# EAGLE design medal (EAGLE 6.5.0)

## Sheet 1 of 5
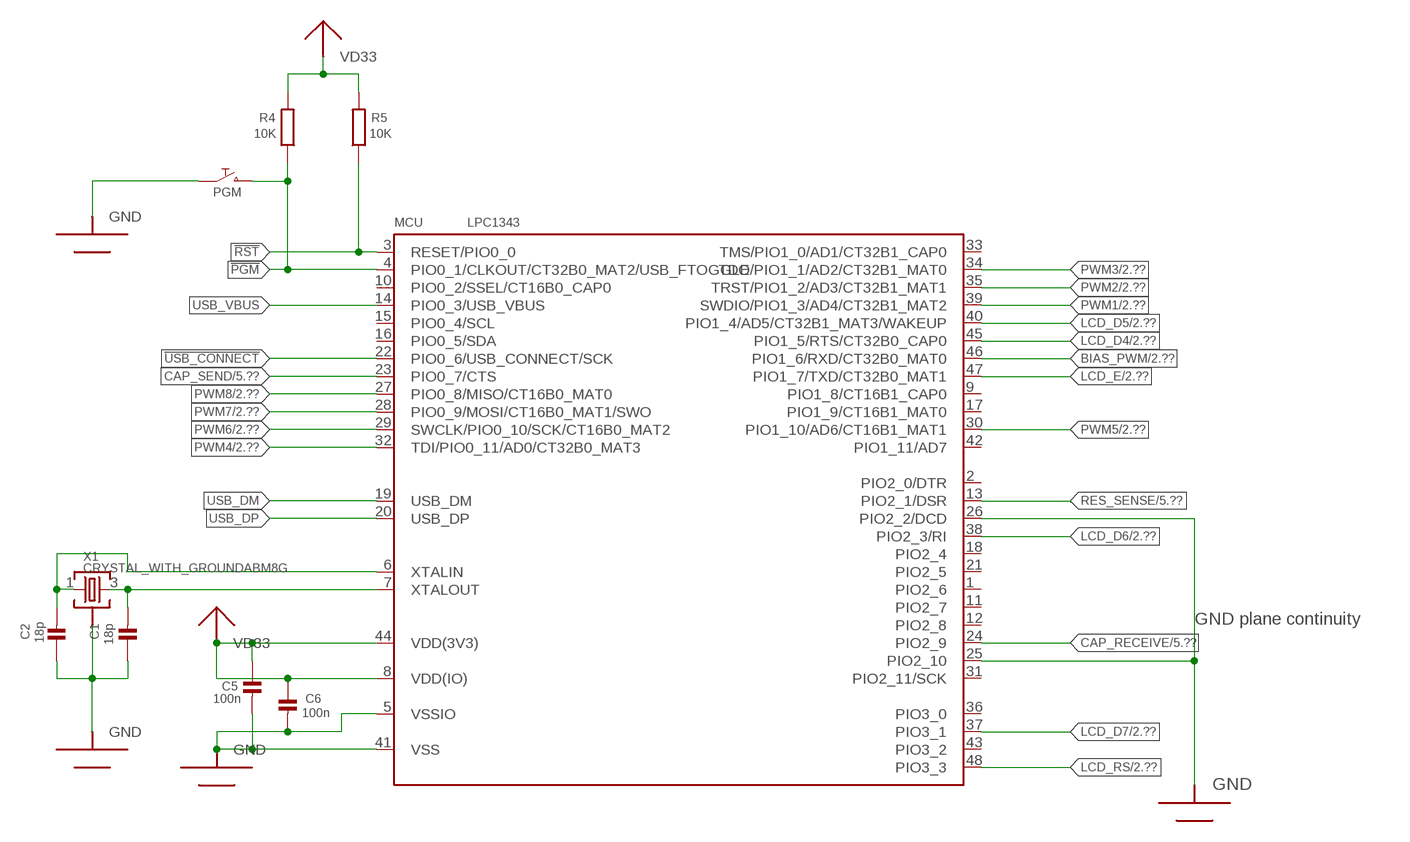
[diagram p0: schematic, sheet 1]

### Parts
C1  18p  CAP_CERAMIC0603-NOSILK  [0603-NOSILK]
C2  18p  CAP_CERAMIC0603-NOSILK  [0603-NOSILK]
C5  100n  CAP_CERAMIC0603-NOSILK  [0603-NOSILK]
C6  100n  CAP_CERAMIC0603-NOSILK  [0603-NOSILK]
MCU  LPC1343  LPC1343_QFPQFP_NOSILK  [QFP48-0.5-NOSILK]
PGM  PUSHBUTTONKMR2XX-NOSILK  [CK-KMR2-NOSILK]
R4  10K  R-EU_0603-NOSILK  [0603-NOSILK]
R5  10K  R-EU_0603-NOSILK  [0603-NOSILK]
X1  CRYSTAL_WITH_GROUNDABM8G  [ABM8G]

### Nets
!PGM: MCU.4(PIO0_1/CLKOUT/CT32B0_MAT2/USB_FTOGGLE) PGM.P$3 PGM.P$4 R4.1
!RST: MCU.3(RESET/PIO0_0) R5.1
!USB_CONNECT: MCU.22(PIO0_6/USB_CONNECT/SCK) ; also sheet 3
BIAS_PWM: MCU.46(PIO1_6/RXD/CT32B0_MAT0) ; also sheet 2
CAP_RECEIVE: MCU.24(PIO2_9) ; also sheet 5
CAP_SEND: MCU.23(PIO0_7/CTS) ; also sheet 5
GND: C1.1 C2.1 C5.2 C6.2 MCU.5(VSSIO) MCU.25(PIO2_10) MCU.26(PIO2_2/DCD) MCU.41(VSS) PGM.P$1 PGM.P$2 X1.2(GND) X1.4(GND) ; also sheet 2,3,4,5
LCD_D4: MCU.45(PIO1_5/RTS/CT32B0_CAP0) ; also sheet 2
LCD_D5: MCU.40(PIO1_4/AD5/CT32B1_MAT3/WAKEUP) ; also sheet 2
LCD_D6: MCU.38(PIO2_3/RI) ; also sheet 2
LCD_D7: MCU.37(PIO3_1) ; also sheet 2
LCD_E: MCU.47(PIO1_7/TXD/CT32B0_MAT1) ; also sheet 2
LCD_RS: MCU.48(PIO3_3) ; also sheet 2
N$1: C2.2 MCU.6(XTALIN) X1.1
N$2: C1.2 MCU.7(XTALOUT) X1.3
PWM1: MCU.39(SWDIO/PIO1_3/AD4/CT32B1_MAT2) ; also sheet 2
PWM2: MCU.35(TRST/PIO1_2/AD3/CT32B1_MAT1) ; also sheet 2
PWM3: MCU.34(TDO/PIO1_1/AD2/CT32B1_MAT0) ; also sheet 2
PWM4: MCU.32(TDI/PIO0_11/AD0/CT32B0_MAT3) ; also sheet 2
PWM5: MCU.30(PIO1_10/AD6/CT16B1_MAT1) ; also sheet 2
PWM6: MCU.29(SWCLK/PIO0_10/SCK/CT16B0_MAT2) ; also sheet 2
PWM7: MCU.28(PIO0_9/MOSI/CT16B0_MAT1/SWO) ; also sheet 2
PWM8: MCU.27(PIO0_8/MISO/CT16B0_MAT0) ; also sheet 2
RES_SENSE: MCU.13(PIO2_1/DSR) ; also sheet 5
USB_DM: MCU.19(USB_DM) ; also sheet 3
USB_DP: MCU.20(USB_DP) ; also sheet 3
USB_VBUS: MCU.14(PIO0_3/USB_VBUS) ; also sheet 3
VD33: C5.1 C6.1 MCU.8(VDD(IO)) MCU.44(VDD(3V3)) R4.2 R5.2 ; also sheet 2,3,4,5
Unconnected: MCU.1(PIO2_6) MCU.2(PIO2_0/DTR) MCU.9(PIO1_8/CT16B1_CAP0) MCU.10(PIO0_2/SSEL/CT16B0_CAP0) MCU.11(PIO2_7) MCU.12(PIO2_8) MCU.15(PIO0_4/SCL) MCU.16(PIO0_5/SDA) MCU.17(PIO1_9/CT16B1_MAT0) MCU.18(PIO2_4) MCU.21(PIO2_5) MCU.31(PIO2_11/SCK) MCU.33(TMS/PIO1_0/AD1/CT32B1_CAP0) MCU.36(PIO3_0) MCU.42(PIO1_11/AD7) MCU.43(PIO3_2)

### Notes on the sheet
- GND plane continuity

## Sheet 2 of 5: LED/Display
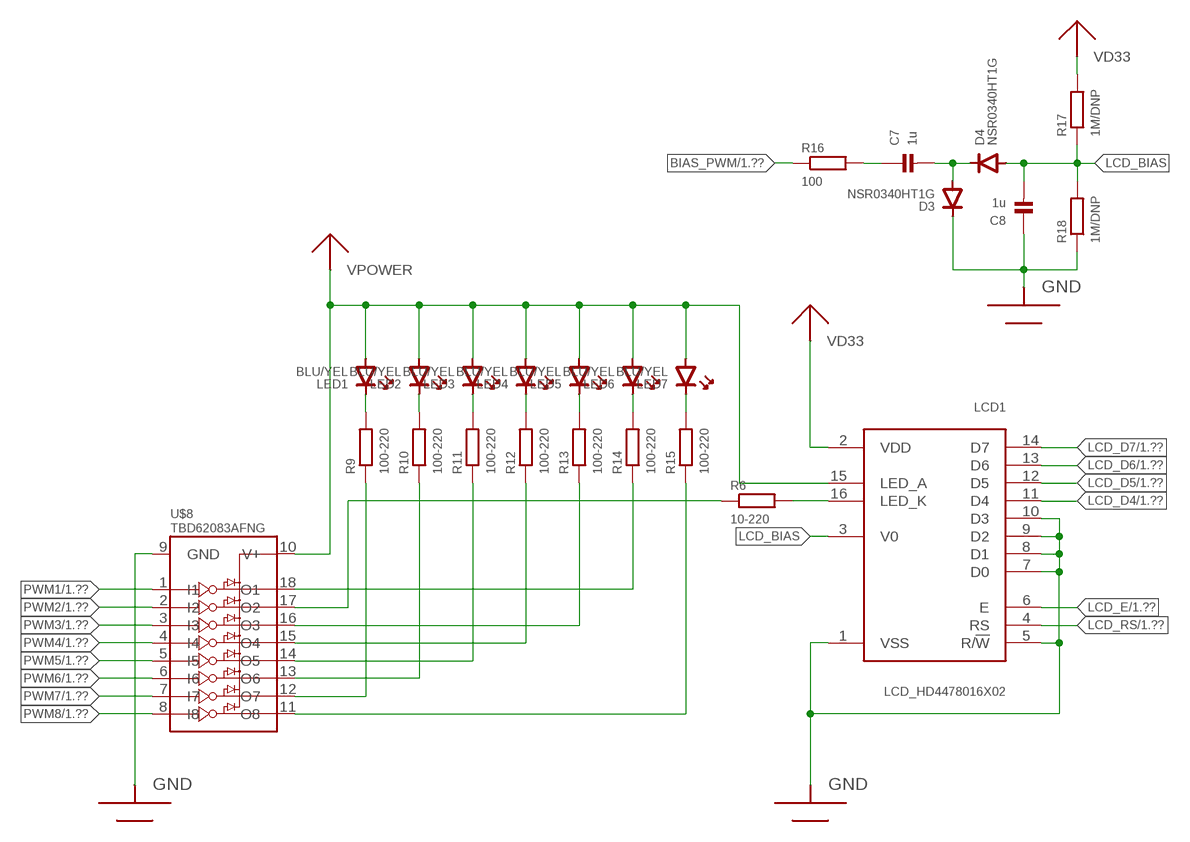
[diagram p1: schematic, sheet 2]

### Parts
C7  1u  CAP_CERAMIC0603-NOSILK  [0603-NOSILK]
C8  1u  CAP_CERAMIC0603-NOSILK  [0603-NOSILK]
D3  NSR0340HT1G  DIODESOD323R-NOPLACE  [SOD323R-NOPLACE]
D4  NSR0340HT1G  DIODESOD323R-NOPLACE  [SOD323R-NOPLACE]
LCD1  LCD_HD4478016X02  [LCD_16X02]
LED1  BLU/YEL  LED0603  [0603_POLAR]
LED2  BLU/YEL  LED0603  [0603_POLAR]
LED3  BLU/YEL  LED0603  [0603_POLAR]
LED4  BLU/YEL  LED0603  [0603_POLAR]
LED5  BLU/YEL  LED0603  [0603_POLAR]
LED6  BLU/YEL  LED0603  [0603_POLAR]
LED7  BLU/YEL  LED0603  [0603_POLAR]
R6  10-220  R-EU_1206-NOSILK  [1206-NOSILK]
R9  100-220  R-EU_0603-NOSILK  [0603-NOSILK]
R10  100-220  R-EU_0603-NOSILK  [0603-NOSILK]
R11  100-220  R-EU_0603-NOSILK  [0603-NOSILK]
R12  100-220  R-EU_0603-NOSILK  [0603-NOSILK]
R13  100-220  R-EU_0603-NOSILK  [0603-NOSILK]
R14  100-220  R-EU_0603-NOSILK  [0603-NOSILK]
R15  100-220  R-EU_0603-NOSILK  [0603-NOSILK]
R16  100  R-EU_0603-NOSILK  [0603-NOSILK]
R17  1M/DNP  R-EU_0603-NOSILK  [0603-NOSILK]
R18  1M/DNP  R-EU_0603-NOSILK  [0603-NOSILK]
U$8  TBD62083AFNG  LOW_SIDE_DRIVERX8NOPLACE  [SSOP18-4.4-0.65-NOPLACE]

### Nets
BIAS_PUMP: C7.2 D3.A(ANODE) D4.K(CATHODE)
BIAS_PWM: R16.1 ; also sheet 1
BIAS_PWM_LIM: C7.1 R16.2
GND: C8.1 D3.K(CATHODE) LCD1.1(VSS) LCD1.5(R/!W) LCD1.7(D0) LCD1.8(D1) LCD1.9(D2) LCD1.10(D3) R18.1 U$8.9(GND) ; also sheet 1,3,4,5
LCD_BIAS: C8.2 D4.A(ANODE) LCD1.3(V0) R17.1 R18.2
LCD_D4: LCD1.11(D4) ; also sheet 1
LCD_D5: LCD1.12(D5) ; also sheet 1
LCD_D6: LCD1.13(D6) ; also sheet 1
LCD_D7: LCD1.14(D7) ; also sheet 1
LCD_E: LCD1.6(E) ; also sheet 1
LCD_RS: LCD1.4(RS) ; also sheet 1
N$5: R6.1 U$8.17(O2)
N$6: LCD1.16(LED_K) R6.2
N$7: R13.1 U$8.16(O3)
N$8: R10.1 U$8.13(O6)
N$9: LED1.K(CATHODE) R9.2
N$10: LED2.K(CATHODE) R10.2
N$11: LED3.K(CATHODE) R11.2
N$12: LED4.K(CATHODE) R12.2
N$13: LED5.K(CATHODE) R13.2
N$14: LED6.K(CATHODE) R14.2
N$15: LED7.K(CATHODE) R15.2
OC2: R9.1 U$8.12(O7)
OC4: R11.1 U$8.14(O5)
OC5: R12.1 U$8.15(O4)
OC7: R14.1 U$8.18(O1)
OC8: R15.1 U$8.11(O8)
PWM1: U$8.1(I1) ; also sheet 1
PWM2: U$8.2(I2) ; also sheet 1
PWM3: U$8.3(I3) ; also sheet 1
PWM4: U$8.4(I4) ; also sheet 1
PWM5: U$8.5(I5) ; also sheet 1
PWM6: U$8.6(I6) ; also sheet 1
PWM7: U$8.7(I7) ; also sheet 1
PWM8: U$8.8(I8) ; also sheet 1
VD33: LCD1.2(VDD) R17.2 ; also sheet 1,3,4,5
VPOWER: LCD1.15(LED_A) LED1.A(ANODE) LED2.A(ANODE) LED3.A(ANODE) LED4.A(ANODE) LED5.A(ANODE) LED6.A(ANODE) LED7.A(ANODE) U$8.10(V+) ; also sheet 4

## Sheet 3 of 5: USB
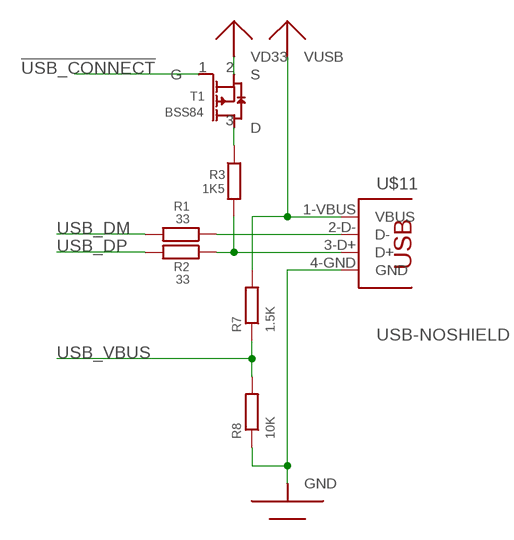
[diagram p2: schematic, sheet 3]

### Parts
R1  33  R-EU_0603-NOSILK  [0603-NOSILK]
R2  33  R-EU_0603-NOSILK  [0603-NOSILK]
R3  1K5  R-EU_0603-NOSILK  [0603-NOSILK]
R7  1.5K  R-EU_0603-NOSILK  [0603-NOSILK]
R8  10K  R-EU_0603-NOSILK  [0603-NOSILK]
T1  BSS84  PMOS_ENHSOT23-NOSILK  [SOT23-NOPLACE]
U$11  USB-NOSHIELD  [USB-A-PCB]

### Nets
!USB_CONNECT: T1.1(G) ; also sheet 1
GND: R8.1 U$11.4-GND(GND) ; also sheet 1,2,4,5
N$3: R3.1 T1.3(D)
USB_D+: R2.1 R3.2 U$11.3-D+(D+)
USB_D-: R1.1 U$11.2-D-(D-)
USB_DM: R1.2 ; also sheet 1
USB_DP: R2.2 ; also sheet 1
USB_VBUS: R7.1 R8.2 ; also sheet 1
VD33: T1.2(S) ; also sheet 1,2,4,5
VUSB: R7.2 U$11.1-VBUS(VBUS) ; also sheet 4

## Sheet 4 of 5: Power
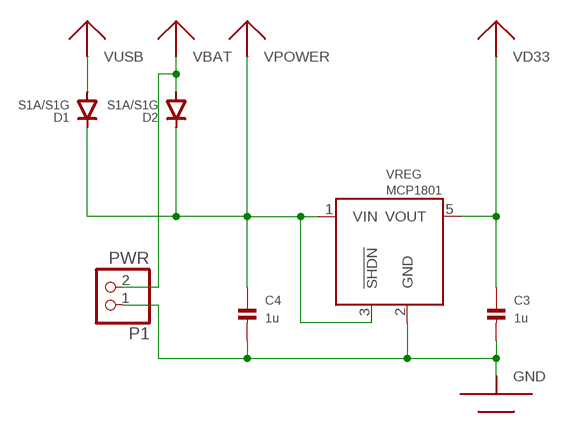
[diagram p3: schematic, sheet 4]

### Parts
C3  1u  CAP_CERAMIC0603-NOSILK  [0603-NOSILK]
C4  1u  CAP_CERAMIC0603-NOSILK  [0603-NOSILK]
D1  S1A/S1G  DIODEDSMA-NOPLACE  [DSMA-NOPLACE]
D2  S1A/S1G  DIODEDSMA-NOPLACE  [DSMA-NOPLACE]
P1  PWR  HEADER-2ROUND  [1X02_ROUND]
VREG  MCP1801  LDO_ENABLESOT-23-5-NOSILK  [SOT-23-5-NOSILK]

### Nets
GND: C3.2 C4.2 P1.1 VREG.2(GND) ; also sheet 1,2,3,5
VBAT: D2.A(ANODE) P1.2
VD33: C3.1 VREG.5(VOUT) ; also sheet 1,2,3,5
VPOWER: C4.1 D1.C(CATHODE) D2.C(CATHODE) VREG.1(VIN) VREG.3(!SHDN) ; also sheet 2
VUSB: D1.A(ANODE) ; also sheet 3

## Sheet 5 of 5: Touch Sense
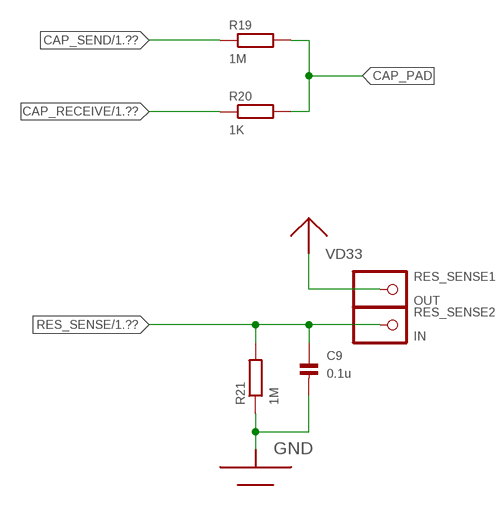
[diagram p4: schematic, sheet 5]

### Parts
C9  0.1u  CAP_CERAMIC0603-NOSILK  [0603-NOSILK]
R19  1M  R-EU_0603-NOSILK  [0603-NOSILK]
R20  1K  R-EU_0603-NOSILK  [0603-NOSILK]
R21  1M  R-EU_0603-NOSILK  [0603-NOSILK]
RES_SENSE1  OUT  HEADER-1X1SMALL  [1X01_1MM_ROUND]
RES_SENSE2  IN  HEADER-1X1SMALL  [1X01_1MM_ROUND]

### Nets
CAP_PAD: R19.2 R20.2
CAP_RECEIVE: R20.1 ; also sheet 1
CAP_SEND: R19.1 ; also sheet 1
GND: C9.2 R21.1 ; also sheet 1,2,3,4
RES_SENSE: C9.1 R21.2 RES_SENSE2.P$2 ; also sheet 1
VD33: RES_SENSE1.P$2 ; also sheet 1,2,3,4

## Library data of the parts
C1-C9 = everykey:CAP_CERAMIC: Ceramic Capacitors 0603 - 0603 Surface Mount Capacitors 3pF 250V +/-0.1pF RF Ceramic Capacitor[Digikey: 712-1347-1-ND] 16 pF 50V 5% Ceramic Capacitor[Digikey: 445-5051-2-ND] 18 pF 250V 5% RF Ceramic Capcitor [Digikey: 478-3505-1-ND] 22 pF 50V Ceramic Capacitor [Digikey: PCC220ACVTR-ND] 33 pF 50V 5% Ceramic Capacitor 56 pF 250V 5% C0G RF Ceramic Capcitor [Digikey: 490-4867-1-ND] 680 pF 50V Ceramic Capacitor 2200 pF 50V 5% C0G Ceramic Capacitor [Digikey: 445-1297-1-ND] 5600 pF 100V 5% X7R Ceramic Capacitor [Digikey: 478-3711-1-ND] 0.1 µF 25V 10% Ceramic Capacitor [Digikey: PCC2277TR-ND] 0.22 µF 16V 10% X7R Ceramic Capacitor [Digikey: 445-1318-1-ND] 1.0 µF 25V 10% Ceramic Capacitor [Digikey: 445-5146-2-ND] 0805 - 0805 Surface Mount Capacitors 220 pF 250V 2% RF Ceramic Capacitor [Digikey: 712-1398-1-ND] 1000 pF 50V 2% NP0 Ceramic Capacitor [Digikey: 478-3760-1-ND] 0.1 µF 25V 10% Ceramic Capacitor [Digikey: PCC1828TR-ND] 1.0 µF 16V 10% Ceramic Capacitor[Digikey: 490-1691-2-ND] 10.0 µF 10V 10% Ceramic Capacitor[Digikey: 709-1228-1-ND] 1206 - 1206 Surface Mount Capacitors
D1-D4 = everykey:DIODE: Dioden in allen Variationen, die mir bis jetzt über den Weg gelaufen sind.
LCD1 = everykey:LCD_HD44780: Cheap dot matrix text display, using HD44780 or compatible controller
LED1-LED7 = everykey:LED: LED common
MCU = everykey:LPC1343_QFP: LPC1343 72 MHz 32-bit ARM Cortex-M3 microcontroller. 32 kB Flash, 8 kB SRAM, USB Device Mouser: 771-LPC1343FBD48151 Digikey: 568-4945-ND
P1 = everykey:HEADER-2: PIN HEADER
PGM = everykey:PUSHBUTTON: Push button 1 x momentary close switches
R1-R21 = everykey:R-EU_: RESISTOR, European symbol
RES_SENSE1 RES_SENSE2 = everykey:HEADER-1X1: PIN HEADER
T1 = everykey:PMOS_ENH: P-Channel MOSFET, enhancement type
U$8 = everykey:LOW_SIDE_DRIVERX8: Open drain driver array, e.g. TBD62083
U$11 = everykey:USB-NOSHIELD
VREG = everykey:LDO_ENABLE: Microchip MCP1801 3.3V LDO with enable, 150mA, max. Vin: 10V. SOT23-5 package. Diodes Inc AP2204 3.3V LDO with enable, 150mA, max. Vin:24V. SOT23-5 package.
X1 = MEINZEUG:CRYSTAL_WITH_GROUND

## Board
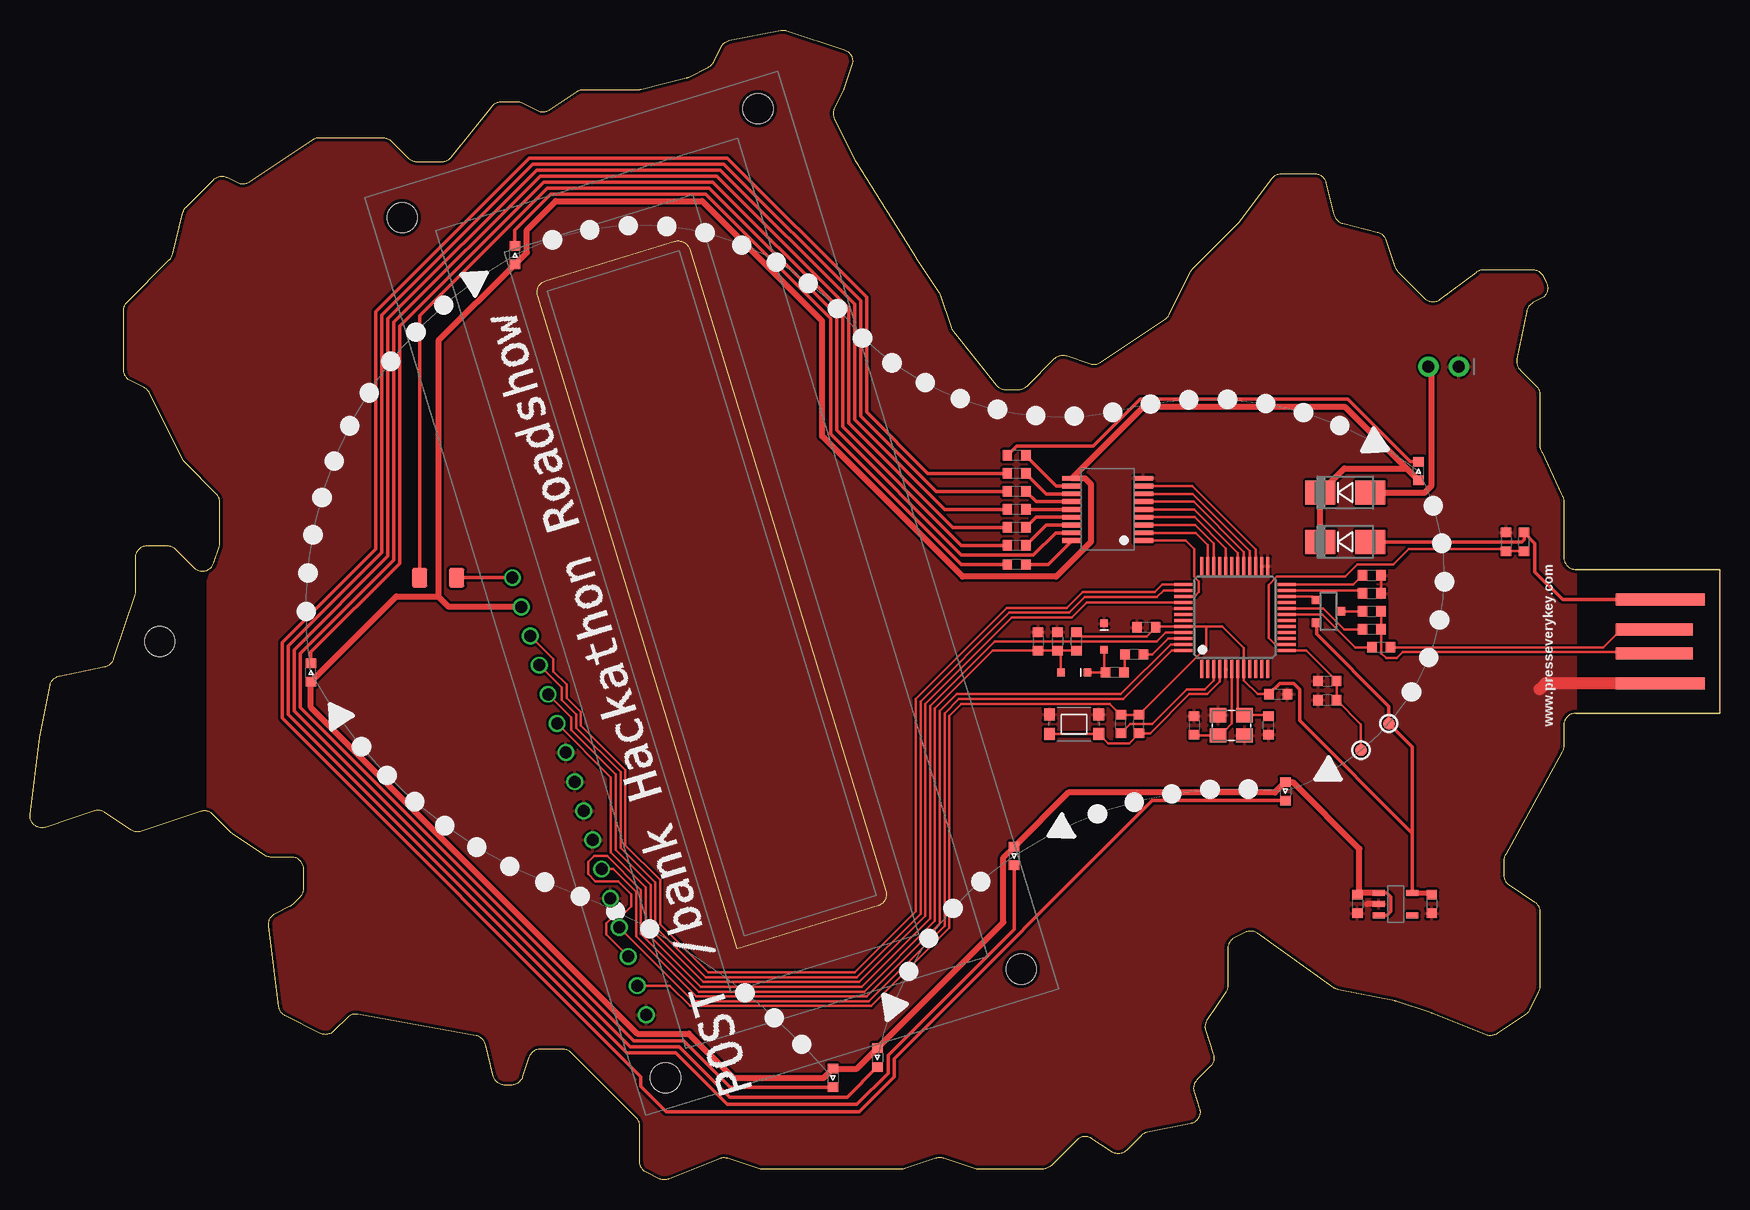
[diagram p5: board, top side]

Size 140.81 x 95.87 mm. Coordinates in mm from the lower left corner, seen from the top.
Outline: 140.81,38.9 128.81,38.9 arc90 127.81,37.9 127.81,36.21 arc-34 127.64,35.65 122.98,27.16 arc34 122.81,26.6 122.81,25.44 arc56 123.26,24.61 125.37,23.2 arc-56 125.81,22.37 125.81,16.14 arc-27 125.7,15.69 124.93,14.14 arc-30 124.59,13.76 122.25,12.2 arc-55 121.32,12.1 116.84,13.89 arc3 116.78,13.91 113.87,14.88 arc7 113.75,14.92 109.02,15.86 arc-24 108.64,16.03 102.3,20.55 arc62 101.27,20.63 100.36,20.18 arc63 99.81,19.29 99.81,16.21 arc-34 99.64,15.65 98.08,13.31 arc52 97.97,12.44 98.62,10.49 arc-63 98.37,9.47 97.25,8.34 arc63 97.01,7.32 97.45,5.98 arc-97 96.7,4.68 93.11,3.96 arc34 92.6,3.69 91.39,2.48 arc-79 90.13,2.36 88.49,3.45 arc79 87.23,3.32 85.1,1.2 arc-45 84.4,0.9 78.97,0.9 arc-18 78.66,0.95 76.13,1.8 arc37 75.49,1.8 72.96,0.95 arc-18 72.65,0.9 60.97,0.9 arc-18 60.66,0.95 58.16,1.79 arc40 57.47,1.77 53.23,0.07 arc-48 52.41,0.1 51.36,0.63 arc-63 50.81,1.52 50.81,4.49 arc45 50.52,5.2 45.1,10.61 arc45 44.4,10.9 42.53,10.9 arc72 41.58,10.22 41.04,8.59 arc-72 40.09,7.9 39.59,7.9 arc-76 38.62,8.66 37.97,11.28 arc66 37.18,12.02 27.33,13.81 arc55 26.44,13.53 25.32,12.41 arc-72 24.17,12.23 21.29,13.66 arc-56 20.74,14.43 19.9,21.2 arc-71 20.44,22.22 21.67,22.83 arc18 21.93,23.02 22.52,23.61 arc45 22.81,24.32 22.81,25.9 arc90 21.81,26.9 20.11,26.9 arc-34 19.56,27.07 16.89,28.85 arc-11 16.74,28.97 15.25,30.47 arc63 14.22,30.71 9.27,29.06 arc-52 8.4,29.17 6.22,30.63 arc52 5.35,30.75 1.32,29.41 arc-116 0.01,30.48 0.81,36.9 1.68,41.25 arc-67 2.46,42.03 6.24,42.79 arc60 6.99,43.45 8.76,48.75 arc18 8.81,49.07 8.81,51.9 arc-90 9.81,52.9 11.4,52.9 arc-45 12.1,52.61 13.67,51.05 arc117 15.32,51.44 15.76,52.75 arc18 15.81,53.07 15.81,56.49 arc45 15.52,57.2 12.93,59.79 arc-18 12.74,60.05 9.96,65.61 arc37 9.51,66.05 8.36,66.63 arc-63 7.81,67.52 7.81,72.49 arc-45 8.1,73.2 11.61,76.71 arc31 11.88,77.17 12.74,80.63 arc-31 13.01,81.1 15.3,83.39 arc-72 16.46,83.58 17.29,83.16 arc60 18.29,83.23 23.56,86.74 arc-34 24.11,86.9 29.4,86.9 arc-45 30.1,86.61 31.52,85.2 arc45 32.22,84.9 34.33,84.9 arc51 35.11,85.28 38.51,89.53 arc-51 39.29,89.9 40.57,89.9 arc-27 41.02,89.8 42.29,89.16 arc60 43.29,89.23 45.56,90.74 arc-34 46.11,90.9 50.69,90.9 arc14 50.93,90.93 54.7,91.88 arc13 54.91,91.95 56.51,92.75 arc37 56.96,93.2 57.59,94.47 arc-52 58.29,95 62.55,95.85 arc-30 63.06,95.82 67.86,94.22 arc-90 68.49,92.95 67.83,90.97 arc-8 67.78,90.84 67.03,89.35 arc53 67.03,88.46 68.79,84.95 arc5 68.84,84.86 73.8,76.92 arc2 73.82,76.89 75.74,74.01 arc-15 75.85,73.78 76.75,71.07 arc20 76.92,70.76 80.51,66.28 arc51 81.29,65.9 82.4,65.9 arc45 83.1,66.2 85.37,68.47 arc-63 86.4,68.71 88.35,68.06 arc52 89.22,68.17 94.59,71.76 arc30 94.93,72.14 96.74,75.76 arc-18 96.93,76.02 100.76,79.85 arc8 100.85,79.96 103.51,83.5 arc-53 104.31,83.9 107.03,83.9 arc-76 108,83.15 108.66,80.49 arc62 109.39,79.76 112.28,79.04 arc-58 112.98,78.38 113.74,76.13 arc27 113.98,75.74 116.2,73.52 arc82 117.5,73.42 120.54,75.7 arc-37 121.14,75.9 125.19,75.9 arc-63 126.09,75.35 126.36,74.8 arc-90 125.92,73.46 125.25,73.12 arc52 124.71,72.42 123.92,68.43 arc56 124.19,67.53 125.52,66.2 arc-45 125.81,65.49 125.81,61.24 arc37 126.01,60.64 127.61,57.17 arc-37 127.81,56.57 127.81,51.9 arc90 128.81,50.9 140.81,50.9 140.81,38.9
Copper layers (1*16): Top 0.035mm / dielectric 1.5mm / Bottom 0.035mm
Design rules "default": minimum track width 0.2mm, minimum drill 0.3mm, track to track 0.2mm, track to pad 0.2mm, pad to pad 0.2mm, via to via 0.2mm, smd to smd 0.2mm, copper to edge 0.3mm, drill to drill 0.2mm, minimum pad ring 0.2mm, minimum via ring 0.15mm, stop-mask expansion 0.075mm, vias tented up to drill 12mil, thermal gap 0.2mm
Holes 2.5 mm at 10.81,44.9
Milling: 7 lines

### Footprints (pad centres in the part's own frame; a part is rotated, then mirrored left to right if it is on the bottom)
0603-NOSILK = smd 0.787 x 0.864: 1 -0.775,0; 2 0.775,0
DSMA-NOPLACE = smd 2.5 x 2: A -2.083,0; C 2.083,0
SOD323R-NOPLACE = smd 0.635 x 0.635: A -1.1,0; K 1.1,0
LCD_16X02 = drill 1: 1 -32,15.5; 2 -29.46,15.5; 3 -26.92,15.5; 4 -24.38,15.5; 5 -21.84,15.5; 6 -19.3,15.5; 7 -16.76,15.5; 8 -14.22,15.5; 9 -11.68,15.5; 10 -9.14,15.5; 11 -6.6,15.5; 12 -4.06,15.5; 13 -1.52,15.5; 14 1.02,15.5; 15 3.56,15.5; 16 6.1,15.5 | hole 2.5: -37.5,15.5; -37.5,-15.5; 37.5,-15.5; 37.5,15.5
0603_POLAR = smd 0.787 x 0.864: A -0.775,0; K 0.775,0
QFP48-0.5-NOSILK = smd 1.5 x 0.25: 1 -4.3,2.75; 2 -4.3,2.25; 3 -4.3,1.75; 4 -4.3,1.25; 5 -4.3,0.75; 6 -4.3,0.25; 7 -4.3,-0.25; 8 -4.3,-0.75; 9 -4.3,-1.25; 10 -4.3,-1.75; 11 -4.3,-2.25; 12 -4.3,-2.75; 25 4.3,-2.75; 26 4.3,-2.25; 27 4.3,-1.75; 28 4.3,-1.25; 29 4.3,-0.75; 30 4.3,-0.25; 31 4.3,0.25; 32 4.3,0.75; 33 4.3,1.25; 34 4.3,1.75; 35 4.3,2.25; 36 4.3,2.75 | smd 0.25 x 1.5: 13 -2.75,-4.3; 14 -2.25,-4.3; 15 -1.75,-4.3; 16 -1.25,-4.3; 17 -0.75,-4.3; 18 -0.25,-4.3; 19 0.25,-4.3; 20 0.75,-4.3; 21 1.25,-4.3; 22 1.75,-4.3; 23 2.25,-4.3; 24 2.75,-4.3; 37 2.75,4.3; 38 2.25,4.3; 39 1.75,4.3; 40 1.25,4.3; 41 0.75,4.3; 42 0.25,4.3; 43 -0.25,4.3; 44 -0.75,4.3; 45 -1.25,4.3; 46 -1.75,4.3; 47 -2.25,4.3; 48 -2.75,4.3
1X02_ROUND = drill 1 pad 1.676: 1 -1.27,0; 2 1.27,0
CK-KMR2-NOSILK = smd 1 x 0.9: P$1 -0.8,2.05; P$2 -0.8,-2.05; P$3 0.8,2.05; P$4 0.8,-2.05
1206-NOSILK = smd 1.3 x 1.6: 1 -1.55,0; 2 1.55,0
1X01_1MM_ROUND = smd 1 x 1: P$2 0,0
SOT23-NOPLACE = smd 0.7 x 0.8: 1 -0.95,-1; 2 0.95,-1; 3 0,1
SSOP18-4.4-0.65-NOPLACE = smd 1.6 x 0.4: 1 -2.975,2.6; 2 -2.975,1.95; 3 -2.975,1.3; 4 -2.975,0.65; 5 -2.975,0; 6 -2.975,-0.65; 7 -2.975,-1.3; 8 -2.975,-1.95; 9 -2.975,-2.6; 10 2.975,-2.6; 11 2.975,-1.95; 12 2.975,-1.3; 13 2.975,-0.65; 14 2.975,0; 15 2.975,0.65; 16 2.975,1.3; 17 2.975,1.95; 18 2.975,2.6
USB-A-PCB = smd 1 x 7.41: 1-VBUS -3.5,1.055; 4-GND 3.5,1.055 | smd 1 x 6.41: 2-D- -1,0.555; 3-D+ 1,0.555
SOT-23-5-NOSILK = smd 0.5 x 1: 1 -0.95,-1.397; 2 0,-1.397; 3 0.95,-1.397; 4 0.95,1.397; 5 -0.95,1.397
ABM8G = smd 1.397 x 1.194: 1 -1.105,-0.851; 2 1.105,-0.851; 3 1.105,0.851; 4 -1.105,0.851

### Placement (x,y rotation side)
C1  103.21,37.9 90 top
C2  97.01,37.9 270 top
C3  116.81,23 270 top
C4  110.61,23 270 top
C5  93.04,46.07 180 top
C6  104.01,40.5 0 top
C7  90.41,42.3 180 top
C8  85.61,44.9 270 top
C9  108.11,40 180 top
D1  109.61,53.2 180 top
D2  109.61,57.3 180 top
D3  89.51,45.3 90 top
D4  87.01,42.3 0 top
LCD1  56.81,48.9 107 top
LED1  104.61,32.4 270 top
LED2  82.01,27 270 top
LED3  70.61,10.2 270 top
LED4  66.91,8.5 270 top
LED5  23.41,42.3 90 top
LED6  40.41,77.1 90 top
LED7  115.71,59.1 90 top
MCU  100.41,46.9 90 top
P1  117.81,67.8 180 top
PGM  87.01,38 270 top
R1  112.61,44.4 180 top
R2  111.81,45.9 180 top
R3  111.81,47.4 0 top
R4  92.41,38 90 top
R5  90.91,38 90 top
R6  34.01,50.2 0 top
R7  124.51,53.2 90 top
R8  123.01,53.2 270 top
R9  82.21,58.9 180 top
R10  82.21,57.4 180 top
R11  82.21,55.9 180 top
R12  82.21,54.4 180 top
R13  82.21,52.9 180 top
R14  82.21,51.3 180 top
R15  82.21,60.4 180 top
R16  92.01,43.8 180 top
R17  87.21,44.9 90 top
R18  84.01,44.9 270 top
R19  111.81,48.9 0 top
R20  111.81,50.4 0 top
R21  108.11,41.6 0 top
RES_SENSE1  113.24,38.05 0 top
RES_SENSE2  110.91,35.82 0 top
T1  108.21,47.4 270 top
U$8  89.81,55.9 180 top
U$11  134.81,44.9 270 top
VREG  113.81,23 270 top
X1  100.11,37.9 0 top

### Tracks (layer width: path | path; a pad name or v marks a point on that pad's centre or on a via)
!PGM
  Top 0.2: MCU.4 99.16,41.55 98.11,40.5 96.61,40.5 93.34,37.23 R4.1 | R4.1 92.69,37.5 | PGM.P$4 PGM.P$3 89.86,36.4 91.59,36.4 R4.1
!RST
  Top 0.2: MCU.3 98.66,41.65 97.91,40.9 96.41,40.9 93.51,38 91.69,38 R5.1
!USB_CONNECT
  Top 0.2: MCU.22 106.91,48.65 T1.1
BIAS_PUMP
  Top 0.2: D3.A 89.51,42.43 C7.2 D4.K
BIAS_PWM
  Top 0.2: MCU.46 94.86,45.15 93.51,43.8 R16.1
BIAS_PWM_LIM
  Top 0.2: R16.2 91.24,42.35 C7.1
CAP_PAD
  Top 0.2: R19.2 R20.2
  pour Top: 112.31,50.8 113.71,50.8 115.11,52.2 123.71,52.2 125.11,52.1 125.11,50.7 127.61,48.2 128.81,48.2 128.81,44.5 113.31,44.5 113.31,48.5 112.31,48.5
CAP_RECEIVE
  Top 0.2: MCU.24 110.29,49.65 R20.1
CAP_SEND
  Top 0.2: MCU.23 110.79,49.15 R19.1
GND
  Top 0.5: VREG.2 111.41,23
  Top 1: U$11.4-GND 126.31,41.4 125.81,40.9
  pour Top (rank 2): 128.81,38.9 128.81,50.9 127.81,50.9 127.81,56.9 125.81,60.9 125.81,65.9 123.81,67.9 124.81,72.9 126.81,73.9 125.81,75.9 120.81,75.9 116.81,72.9 113.81,75.9 112.81,78.9 108.81,79.9 107.81,83.9 103.81,83.9 100.81,79.9 96.81,75.9 94.81,71.9 88.81,67.9 85.81,68.9 82.81,65.9 80.81,65.9 76.81,70.9 75.81,73.9 68.81,84.9 66.81,88.9 67.81,90.9 68.81,93.9 62.81,95.9 57.81,94.9 56.81,92.9 54.81,91.9 50.81,90.9 45.81,90.9 42.81,88.9 40.81,89.9 38.81,89.9 34.81,84.9 31.81,84.9 29.81,86.9 23.81,86.9 17.81,82.9 15.81,83.9 12.81,80.9 11.81,76.9 7.81,72.9 7.81,66.9 9.81,65.9 12.81,59.9 15.81,56.9 15.81,52.9 14.81,49.9 14.81,30.9 16.81,28.9 19.81,26.9 22.81,26.9 22.81,23.9 21.81,22.9 19.81,21.9 20.81,13.9 24.81,11.9 26.81,13.9 37.81,11.9 38.81,7.9 40.81,7.9 41.81,10.9 44.81,10.9 50.81,4.9 50.81,0.9 52.81,-0.1 57.81,1.9 60.81,0.9 72.81,0.9 75.81,1.9 78.81,0.9 84.81,0.9 87.81,3.9 90.81,1.9 92.81,3.9 97.81,4.9 96.81,7.9 98.81,9.9 97.81,12.9 99.81,15.9 99.81,19.9 101.81,20.9 108.81,15.9 116.81,13.9 121.81,11.9 124.81,13.9 125.81,15.9 125.81,22.9 122.81,24.9 122.81,26.9 127.81,35.9 127.81,38.9
LCD_BIAS
  Top 0.2: R17.1 C8.2 | C8.2 R18.2 80.24,44.13 75.41,39.3 75.41,21.6 69.51,15.7 55.71,15.7 50.91,20.5 50.91,24.2 48.11,27 47.01,27 46.51,26.5 46.51,25.5 47.11,24.9 49.01,24.9 50.11,23.8 50.11,22.8 49.41,22.1 48.71,22.1 48.01,21.4 48.01,20.48 LCD1.3 | D4.A 85.91,43.83 C8.2
LCD_D4
  Top 0.2: MCU.45 94.66,45.65 93.91,44.9 80.41,44.9 75.01,39.5 75.01,21.8 69.31,16.1 55.91,16.1 51.31,20.7 51.31,24.4 48.41,27.3 48.41,33.57 LCD1.11
LCD_D5
  Top 0.2: MCU.40 88.06,48.15 86.81,46.9 81.81,46.9 74.61,39.7 74.61,22 69.11,16.5 56.11,16.5 51.71,20.9 51.71,24.6 48.81,27.5 48.81,33.8 45.11,37.5 45.11,38.55 LCD1.12
LCD_D6
  Top 0.2: MCU.38 94.46,49.15 93.91,48.6 87.91,48.6 86.61,47.3 81.61,47.3 74.21,39.9 74.21,22.2 68.91,16.9 56.31,16.9 52.11,21.1 52.11,24.8 49.21,27.7 49.21,34 45.51,37.7 45.51,38.8 44.31,40 44.31,41.04 LCD1.13
LCD_D7
  Top 0.2: MCU.37 94.36,49.65 93.71,49 87.71,49 86.41,47.7 81.41,47.7 73.81,40.1 73.81,22.4 68.71,17.3 56.51,17.3 52.51,21.3 52.51,25 49.61,27.9 49.61,34.2 45.91,37.9 45.91,39 44.71,40.2 44.71,41.3 43.61,42.4 43.61,43.43 LCD1.14
LCD_E
  Top 0.2: LCD1.6 48.6,25.92 50.51,24 50.51,20.3 55.51,15.3 69.71,15.3 75.81,21.4 75.81,39.1 77.21,40.5 90.91,40.5 95.06,44.65 MCU.47
LCD_RS
  Top 0.2: LCD1.4 55.27,14.9 69.91,14.9 76.21,21.2 76.21,38.9 77.41,40.1 91.11,40.1 95.16,44.15 MCU.48
N$1
  Top 0.2: MCU.6 100.16,38.05 99.51,37.4 99.36,37.4 X1.1 | X1.1 97.09,37.05 C2.2 | X1.1 99.16,37.05 99.21,37.1
N$2
  Top 0.2: MCU.7 100.66,39.31 X1.3 103.13,38.75 C1.2
N$3
  Top 0.2: T1.3 R3.1
N$5
  Top 0.3: U$8.17 85.46,53.95 83.61,52.1 77.61,52.1 67.21,62.5 67.21,72.1 56.61,82.7 43.11,82.7 32.46,72.05 R6.1
N$6
  Top 0.3: LCD1.16 R6.2
N$7
  Top 0.3: U$8.16 84.69,54.6 R13.1
N$8
  Top 0.3: U$8.13 83.84,56.55 R10.1
N$9
  Top 0.3: R9.2 74.81,58.9 69.71,64 69.71,73.6 58.11,85.2 41.61,85.2 28.81,72.4 28.81,52.6 21.01,44.8 21.01,38.5 50.91,8.6 50.91,7.8 53.01,5.7 69.11,5.7 72.01,8.6 72.01,10.1 93.54,31.63 LED1.K
N$10
  Top 0.3: R10.2 75.51,57.4 69.21,63.7 69.21,73.3 57.81,84.7 41.91,84.7 29.31,72.1 29.31,52.3 21.51,44.5 21.51,38.8 49.71,10.6 53.81,10.6 58.11,6.3 68.91,6.3 71.51,8.9 71.51,10.4 82.01,20.9 LED2.K
N$11
  Top 0.3: R11.2 76.21,55.9 68.71,63.4 68.71,73 57.51,84.2 42.21,84.2 29.81,71.8 29.81,52 22.01,44.2 22.01,39.1 50.01,11.1 54.11,11.1 58.31,6.9 68.09,6.9 LED3.K
N$12
  Top 0.3: LED4.K 58.34,7.73 54.46,11.6 50.31,11.6 22.51,39.4 22.51,43.9 30.31,51.7 30.31,71.5 42.51,83.7 57.21,83.7 68.21,72.7 68.21,63.1 76.91,54.4 R12.2
N$13
  Top 0.3: LED5.K 23.41,44 30.81,51.4 30.81,71.2 42.81,83.2 56.91,83.2 67.71,72.4 67.71,62.8 77.61,52.9 R13.2
N$14
  Top 0.3: LED6.K 40.41,79.2 43.41,82.2 56.31,82.2 66.71,71.8 66.71,62.2 77.61,51.3 R14.2
N$15
  Top 0.3: R15.2 82.24,61.2 88.61,61.2 92.51,65.1 109.81,65.1 115.04,59.88 LED7.K
OC2
  Top 0.3: U$8.12 84.69,57.2 R9.1
OC4
  Top 0.3: U$8.14 R11.1
OC5
  Top 0.3: R12.1 83.84,55.25 U$8.15
OC7
  Top 0.3: U$8.18 84.84,51.3 R14.1
OC8
  Top 0.3: U$8.11 85.54,57.85 R15.1
PWM1
  Top 0.2: MCU.39 97.06,48.65 97.41,49 97.41,49.9 97.01,50.3 97.01,52.6 96.31,53.3 U$8.1
PWM2
  Top 0.2: MCU.35 98.16,52.95 97.16,53.95 U$8.2
PWM3
  Top 0.2: MCU.34 98.66,53.05 97.11,54.6 U$8.3
PWM4
  Top 0.2: MCU.32 99.66,52.65 97.06,55.25 U$8.4
PWM5
  Top 0.2: MCU.30 100.66,52.25 97.01,55.9 U$8.5
PWM6
  Top 0.2: MCU.29 101.16,52.35 96.96,56.55 U$8.6
PWM7
  Top 0.2: MCU.28 101.66,52.45 96.91,57.2 U$8.7
PWM8
  Top 0.2: MCU.27 102.16,52.55 96.86,57.85 U$8.8
RES_SENSE
  Top 0.2: MCU.13 106.34,44.15 R21.2 C9.1 110.91,37.98 RES_SENSE2.P$2
USB_D+
  Top 0.2: U$11.3-D+ 134.97,43.5 134.47,44 114.41,44 113.91,43.5 113.01,43.5 112.61,43.9 112.61,45.88 R2.1 R3.2
USB_D-
  Top 0.2: R1.1 131.11,44.4 132.61,45.9 U$11.2-D-
USB_DM
  Top 0.2: MCU.19 107.7,47.15 110.45,44.4 R1.2
USB_DP
  Top 0.2: MCU.20 107.78,47.65 109.53,45.9 R2.2
USB_VBUS
  Top 0.2: MCU.14 103.76,44.65 103.21,45.2 103.21,49.6 103.91,50.3 109.61,50.3 110.61,51.3 113.61,51.3 114.91,52.6 122.84,52.6 R8.2 R7.1
VBAT
  Top 0.5: D2.A 116.21,57.3 116.81,57.9 116.81,67.53 P1.2
VD33
  Top 0.2: C6.1 102.31,40.5 101.16,41.65 MCU.8 101.16,44.35 99.36,46.15 98.01,46.15 | 98.01,46.15 MCU.44 93.9,46.15 C5.1 93.05,45.3 87.71,45.3 87.34,45.68 R17.2 | 98.01,46.15 98.01,44.38 R4.2 R5.2 89.99,39.7 77.61,39.7 76.61,38.7 76.61,21 70.11,14.5 55.01,14.5 53.32,16.2 LCD1.2
  Top 0.3: C6.1 104.14,41.4 105.31,41.4 105.81,40.9 105.81,38.3 115.21,28.9 | 113.21,38.02 RES_SENSE1.P$2 | T1.2 107.21,45.5 113.24,39.47 RES_SENSE1.P$2 | VREG.5 115.21,28.9 | 115.21,28.9 115.21,36.09 RES_SENSE1.P$2
  Top 0.4: VREG.5 116.64,23.95 C3.1
VPOWER
  Top 0.2: 112.44,23.98 VREG.1
  Top 0.3: VREG.3 113.06,22.05 113.41,22.4 113.41,23.6 113.06,23.95 VREG.1
  Top 0.4: 110.79,23.95 C4.1
  Top 0.5: VREG.1 110.79,23.95 110.79,27.6 105.21,33.18 LED1.A 103.74,32.3 86.54,32.3 LED2.A 81.11,26.88 81.11,21.48 LED3.A 68.91,9.28 LED4.A 66.14,8.5 58.61,8.5 54.91,12.2 50.61,12.2 23.41,39.4 LED5.A 30.53,48.65 34.04,48.65 | LCD1.15 34.91,47.78 34.04,48.65 | 34.04,48.65 34.04,69.95 LED6.A 41.41,77.33 41.41,79.2 43.81,81.6 56.01,81.6 66.01,71.6 66.01,62 77.71,50.3 85.51,50.3 88.41,53.2 88.41,58 87.91,58.5 U$8.10 92.76,64.43 109.61,64.43 114.72,59.32 | D1.C D2.C 109.54,59.32 114.72,59.32 | LED7.A 114.72,59.32
VUSB
  Top 0.3: U$11.1-VBUS 127.71,48.4 125.41,50.7 125.41,53.08 R7.2 124.51,53.4 124.31,53.2 D1.A

### Text on the board
tPlace: www.presseverykey.com
204bmp: /Users/matthias/Desktop/postbank/karte-0-9001.bmp